# Altium schematic sheet printer_tag_device.SchDoc
size A4; DocumentNumber: 1; Revision: V1.0; SheetNumber: 1; SheetTotal: 9
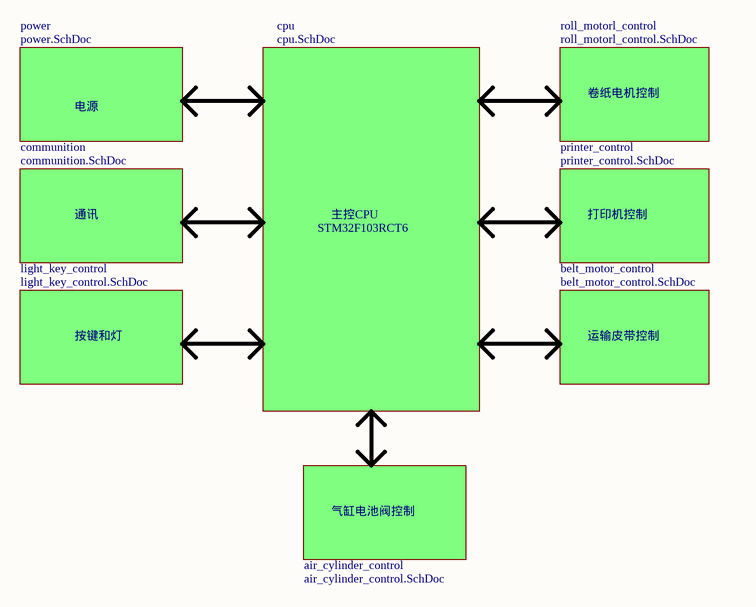
[diagram p0: printer_tag_device.SchDoc]

## Sub-sheets
air_cylinder_control = air_cylinder_control.SchDoc: no entries
belt_motor_control = belt_motor_control.SchDoc: no entries
communition = communition.SchDoc: no entries
cpu = cpu.SchDoc: no entries
light_key_control = light_key_control.SchDoc: no entries
power = power.SchDoc: no entries
printer_control = printer_control.SchDoc: no entries
roll_motorl_control = roll_motorl_control.SchDoc: no entries

## Notes on the sheet
- 电源
- 卷纸电机控制
- 通讯
- STM32F103RCT6
- 主控CPU
- 打印机控制
- 按键和灯
- 运输皮带控制
- 气缸电池阀控制
- :